# EAGLE schematic alim (EAGLE 4.16)
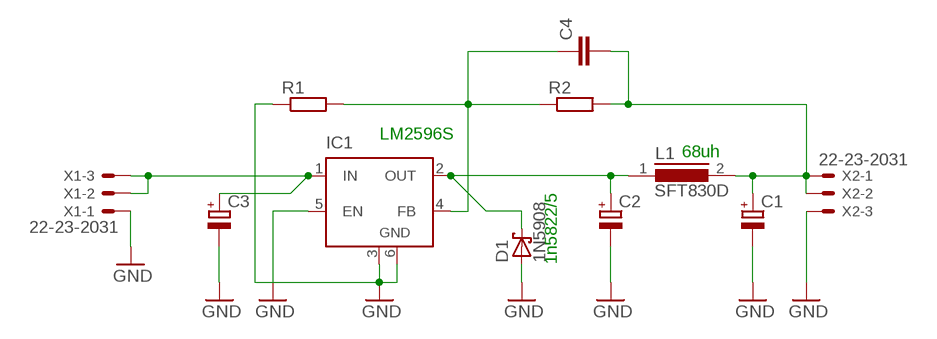
[diagram p0: schematic, sheet 1]

## Parts
C1  CPOL-EUE5-10.5  [E5-10,5]
C2  CPOL-EUE5-10.5  [E5-10,5]
C3  CPOL-EUE5-10.5  [E5-10,5]
C4  C-EU025-025X050  [C025-025X050]
D1  1N5908  [C4111-15]
IC1  LM2596S  [TO263-5]
L1  SFT830D  [SFT830D]
R1  R-EU_0617/22  [0617/22]
R2  R-EU_0207/2V  [0207/2V]
X1  22-23-2031  [22-23-2031]
X2  22-23-2031  [22-23-2031]

## Nets
GND: C1.- C2.- C3.- D1.A IC1.3(GND) IC1.5(EN) IC1.6(GND) R1.1 X1.1 X2.3
N$1: C1.+ C4.2 L1.2 R2.2 X2.1 X2.2
N$3: C3.+ IC1.1(IN) X1.2 X1.3
N$4: C2.+ D1.C IC1.2(OUT) L1.1
N$6: C4.1 IC1.4(FB) R1.2 R2.1

## Notes on the sheet
- LM2596S
- 68uh
- 1n5822/5

## Library data of the parts
C1-C3 = rcl:CPOL-EU: POLARIZED CAPACITOR, European symbol
C4 = rcl:C-EU: CAPACITOR, European symbol
D1 = diode:1N5908: DIODE schottky
IC1 = linear:LM2596S: STEP-DOWN VOLTAGE REGULATOR
L1 = inductors:SFT830D: INDUCTOR
R1 R2 = rcl:R-EU_: RESISTOR, European symbol
X1 X2 = con-molex:22-23-2031: .100" (2.54mm) Center Header - 3 Pin